# Altium schematic sheet SIX_OUTPORT-V2.SchDoc
size A3
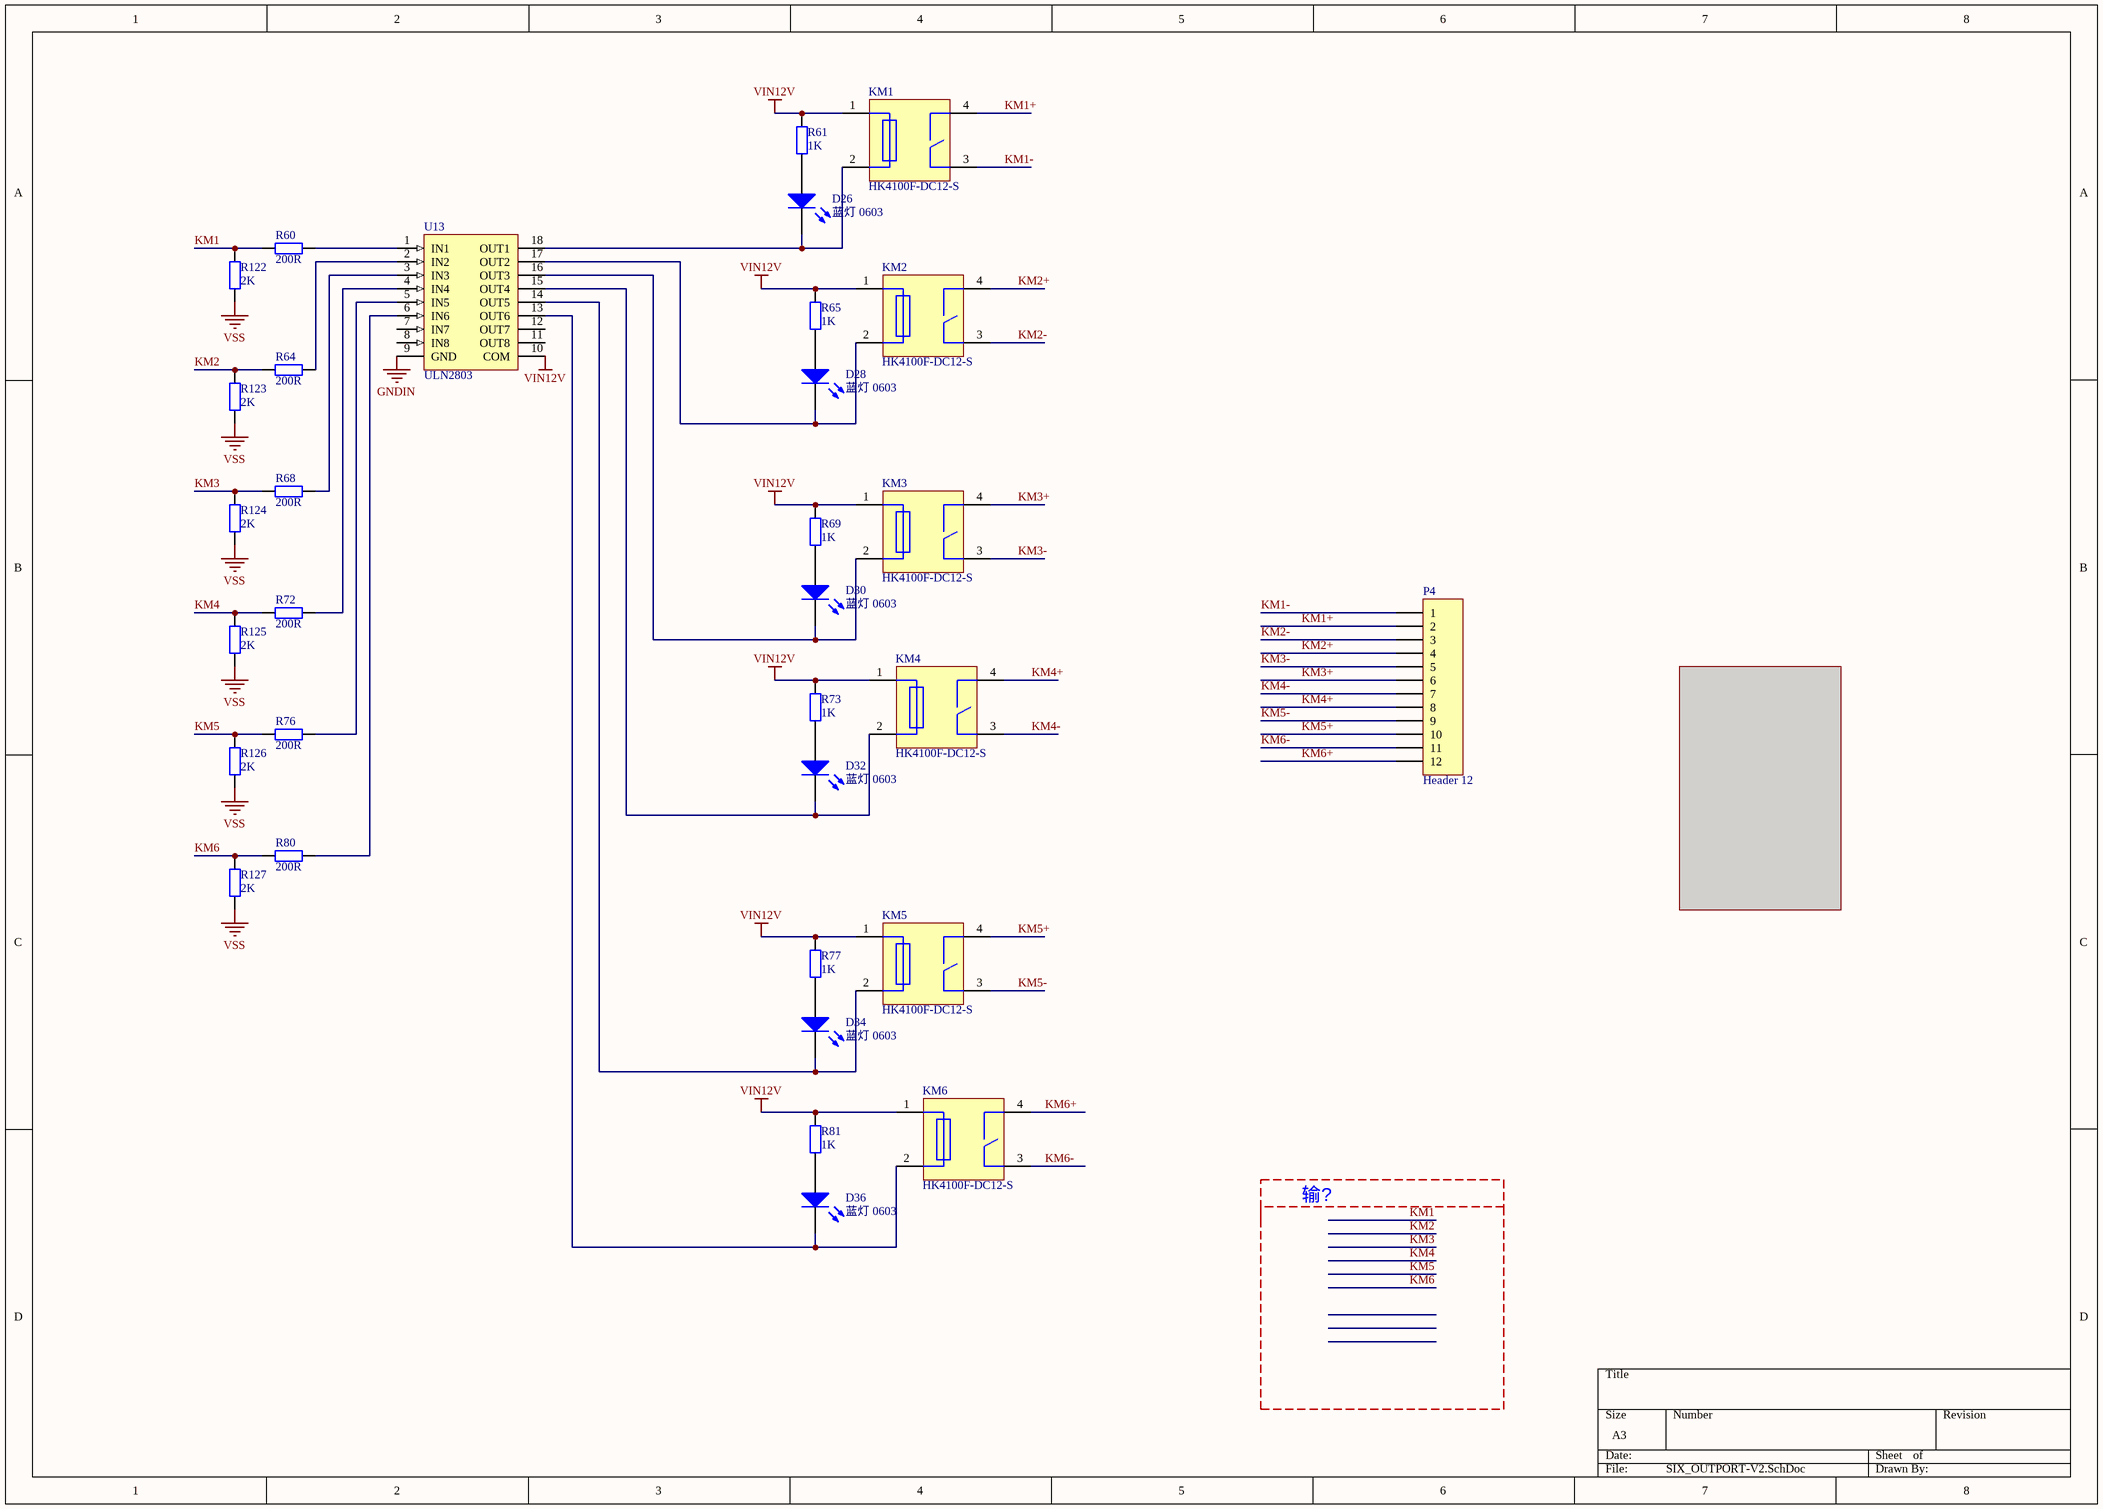
[diagram p0: SIX_OUTPORT-V2.SchDoc]

## Parts
D26  蓝灯 0603  [LC-0603_LED_S1]
D28  蓝灯 0603  [LC-0603_LED_S1]
D30  蓝灯 0603  [LC-0603_LED_S1]
D32  蓝灯 0603  [LC-0603_LED_S1]
D34  蓝灯 0603  [LC-0603_LED_S1]
D36  蓝灯 0603  [LC-0603_LED_S1]
KM1  HK4100F-DC12-S  [JCZ-32F]
KM2  HK4100F-DC12-S  [JCZ-32F]
KM3  HK4100F-DC12-S  [JCZ-32F]
KM4  HK4100F-DC12-S  [JCZ-32F]
KM5  HK4100F-DC12-S  [JCZ-32F]
KM6  HK4100F-DC12-S  [JCZ-32F]
P4  Header 12  [F5.08-12P]
R60  200R  [LC-0603_R]
R61  1K  [LC-0603_R]
R64  200R  [LC-0603_R]
R65  1K  [LC-0603_R]
R68  200R  [LC-0603_R]
R69  1K  [LC-0603_R]
R72  200R  [LC-0603_R]
R73  1K  [LC-0603_R]
R76  200R  [LC-0603_R]
R77  1K  [LC-0603_R]
R80  200R  [LC-0603_R]
R81  1K  [LC-0603_R]
R122  2K  [LC-0603_R]
R123  2K  [LC-0603_R]
R124  2K  [LC-0603_R]
R125  2K  [LC-0603_R]
R126  2K  [LC-0603_R]
R127  2K  [LC-0603_R]
U13  ULN2803  [LC-SOIC-18_300mil]

## Nets
GNDIN: U13.9(GND)
VIN12V: KM1.1 KM2.1 KM3.1 KM4.1 KM5.1 KM6.1 R61.1 R65.1 R69.1 R73.1 R77.1 R81.1 U13.10(COM)
VSS: R122.2 R123.2 R124.2 R125.2 R126.2 R127.2
KM1: R60.2 R122.1
KM1+: KM1.4 P4.2
KM1-: KM1.3 P4.1
KM2: R64.2 R123.1
KM2+: KM2.4 P4.4
KM2-: KM2.3 P4.3
KM3: R68.2 R124.1
KM3+: KM3.4 P4.6
KM3-: KM3.3 P4.5
KM4: R72.2 R125.1
KM4+: KM4.4 P4.8
KM4-: KM4.3 P4.7
KM5: R76.2 R126.1
KM5+: KM5.4 P4.10
KM5-: KM5.3 P4.9
KM6: R80.2 R127.1
KM6+: KM6.4 P4.12
KM6-: KM6.3 P4.11
NetD26_A: D26.A R61.2
NetD26_K: D26.K KM1.2 U13.18(OUT1)
NetD28_A: D28.A R65.2
NetD28_K: D28.K KM2.2 U13.17(OUT2)
NetD30_A: D30.A R69.2
NetD30_K: D30.K KM3.2 U13.16(OUT3)
NetD32_A: D32.A R73.2
NetD32_K: D32.K KM4.2 U13.15(OUT4)
NetD34_A: D34.A R77.2
NetD34_K: D34.K KM5.2 U13.14(OUT5)
NetD36_A: D36.A R81.2
NetD36_K: D36.K KM6.2 U13.13(OUT6)
NetR60_1: R60.1 U13.1(IN1)
NetR64_1: R64.1 U13.2(IN2)
NetR68_1: R68.1 U13.3(IN3)
NetR72_1: R72.1 U13.4(IN4)
NetR76_1: R76.1 U13.5(IN5)
NetR80_1: R80.1 U13.6(IN6)

Not connected (* = marked no-connect by the designer): U13 7(IN7) 8(IN8) 11(OUT8) 12(OUT7)

## Notes on the sheet
- 输?

## Library data of the parts
D26 D28 D30 D32 D34 D36 = 0603 蓝灯: 发光二极管; ComponentLink1Description: 供应商链接; ComponentLink1URL: http://www.szlcsc.com/product/details_73150.html; Package: 0603; Supplier: LC; SuppliersPartNumber: C72041
KM1-KM6 = RELAY-HK4100F: 单刀双掷继电器
P4 = Header 12: Header, 12-Pin; LatestRevisionDate: 17-Jul-2002; LatestRevisionNote: Re-released for DXP Platform.; Publisher: Altium Limited
R60 R64 R68 R72 R76 R80 R122-R127 = Res2: Resistor; Value: 1K; Published: 8-Jun-2000; LatestRevisionDate: 17-Jul-2002; LatestRevisionNote: Re-released for DXP Platform.; PackageReference: AXIAL-0.4; Publisher: Altium Limited
R61 R65 R69 R73 R77 R81 = Res2: Resistor; Published: 8-Jun-2000; LatestRevisionDate: 17-Jul-2002; LatestRevisionNote: Re-released for DXP Platform.; PackageReference: AXIAL-0.4; Publisher: Altium Limited; Value: 1K